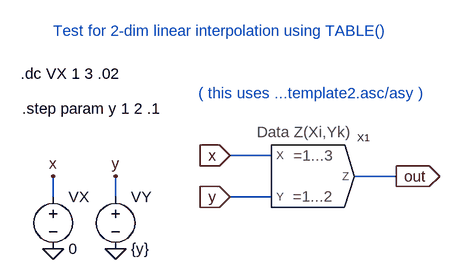
[diagram p0: schematic 2D_Interpolation_TEST2.asc]
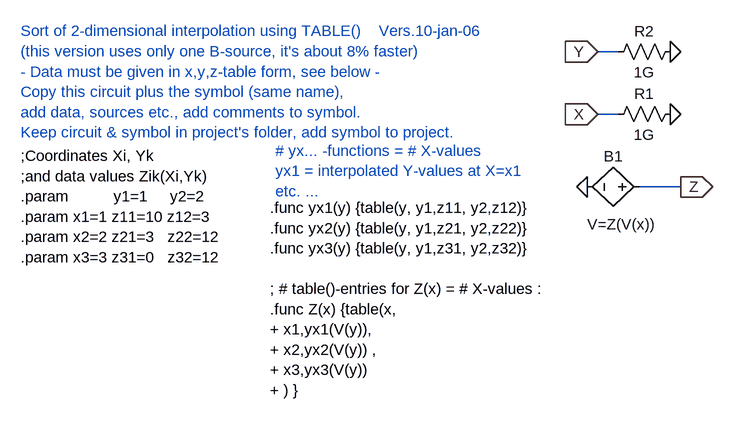
[diagram p1: sub-circuit 2d_interpolation_template2.asc]
2D_Interpolation_TEST2.asc, the LTspice schematic file:
Version 4
SHEET 1 1612 680
WIRE -112 112 -112 80
WIRE -16 112 -16 80
WIRE 224 48 160 48
WIRE 224 112 160 112
WIRE 416 80 352 80
FLAG -112 192 0
FLAG -112 80 x
FLAG -16 192 0
FLAG -16 80 y
FLAG 160 48 x
IOPIN 160 48 In
FLAG 160 112 y
IOPIN 160 112 In
FLAG 416 80 out
IOPIN 416 80 Out
SYMBOL voltage -112 96 R0
SYMATTR InstName VX
SYMATTR Value 0
SYMBOL voltage -16 96 R0
WINDOW 123 0 0 Left 0
WINDOW 39 0 0 Left 0
SYMATTR InstName VY
SYMATTR Value {y}
SYMBOL 2D_Interpolation_template2 272 80 R0
SYMATTR InstName X1
TEXT -162 -78 Left 0 !.dc VX 1 3 .02
TEXT -160 -24 Left 0 !.step param y 1 2 .1
TEXT -112 -144 Left 0 ;Test for 2-dim linear interpolation using TABLE()
TEXT 112 -48 Left 0 ;( this uses ...template2.asc/asy )

2d_interpolation_template2.asc, the sub-circuit schematic file:
Version 4
SHEET 1 1612 680
WIRE 752 -224 720 -224
WIRE 752 -128 720 -128
WIRE 848 -16 784 -16
FLAG 704 -16 0
FLAG 848 -16 Z
IOPIN 848 -16 Out
FLAG 720 -128 X
IOPIN 720 -128 In
FLAG 832 -128 0
FLAG 720 -224 Y
IOPIN 720 -224 In
FLAG 832 -224 0
SYMBOL bv 800 -16 R90
WINDOW 3 42 43 VTop 0
WINDOW 0 -32 56 VBottom 0
SYMATTR Value V=Z(V(x))
SYMATTR InstName B1
SYMBOL res 736 -112 R270
WINDOW 0 32 56 VTop 0
WINDOW 3 0 56 VBottom 0
SYMATTR InstName R1
SYMATTR Value 1G
SYMBOL res 736 -208 R270
WINDOW 0 32 56 VTop 0
WINDOW 3 0 56 VBottom 0
SYMATTR InstName R2
SYMATTR Value 1G
TEXT -168 -64 Left 0 !;Coordinates Xi, Yk\n;and data values Zik(Xi,Yk)\n.param          y1=1     y2=2\n.param x1=1 z11=10 z12=3\n.param x2=2 z21=3   z22=12\n.param x3=3 z31=0   z32=12
TEXT -168 -256 Left 0 ;Sort of 2-dimensional interpolation using TABLE()    Vers.10-jan-06\n(this version uses only one B-source, it's about 8% faster)\n- Data must be given in x,y,z-table form, see below -\nCopy this circuit plus the symbol (same name),\nadd data, sources etc., add comments to symbol.\nKeep circuit & symbol in project's folder, add symbol to project.
TEXT 216 16 Left 0 !.func yx1(y) {table(y, y1,z11, y2,z12)}\n.func yx2(y) {table(y, y1,z21, y2,z22)}\n.func yx3(y) {table(y, y1,z31, y2,z32)}\n \n; # table()-entries for Z(x) = # X-values :\n.func Z(x) {table(x,\n+ x1,yx1(V(y)),\n+ x2,yx2(V(y)) ,\n+ x3,yx3(V(y))\n+ ) }
TEXT 224 -72 Left 0 ;# yx... -functions = # X-values\nyx1 = interpolated Y-values at X=x1\netc. ...

The netlist it stands for:
* 2D_Interpolation_TEST2.asc
VX x 0 0
VY y 0 {y}
XX1 x y out 2d_interpolation_template2

* block symbol definitions
.subckt 2d_interpolation_template2 X Y Z
B1 Z 0 V=Z(V(x))
R1 X 0 1G
R2 Y 0 1G
;Coordinates Xi, Yk
;and data values Zik(Xi,Yk)
.param          y1=1     y2=2
.param x1=1 z11=10 z12=3
.param x2=2 z21=3   z22=12
.param x3=3 z31=0   z32=12
* Sort of 2-dimensional interpolation using TABLE()    Vers.10-jan-06
* (this version uses only one B-source, it's about 8% faster)
* - Data must be given in x,y,z-table form, see below -
* Copy this circuit plus the symbol (same name),
* add data, sources etc., add comments to symbol.
* Keep circuit & symbol in project's folder, add symbol to project.
.func yx1(y) {table(y, y1,z11, y2,z12)}
.func yx2(y) {table(y, y1,z21, y2,z22)}
.func yx3(y) {table(y, y1,z31, y2,z32)}
; # table()-entries for Z(x) = # X-values :
.func Z(x) {table(x,
+ x1,yx1(V(y)),
+ x2,yx2(V(y)) ,
+ x3,yx3(V(y))
+ ) }
* # yx... -functions = # X-values
* yx1 = interpolated Y-values at X=x1
* etc. ...
.ends 2d_interpolation_template2

.dc VX 1 3 .02
.step param y 1 2 .1
* Test for 2-dim linear interpolation using TABLE()
* ( this uses ...template2.asc/asy )
.backanno
.end